# Altium schematic sheet obc-v2_FRAM-FLASH.SchDoc
size 420 x 297 mm; SheetNumber: 8; SheetTotal: 23
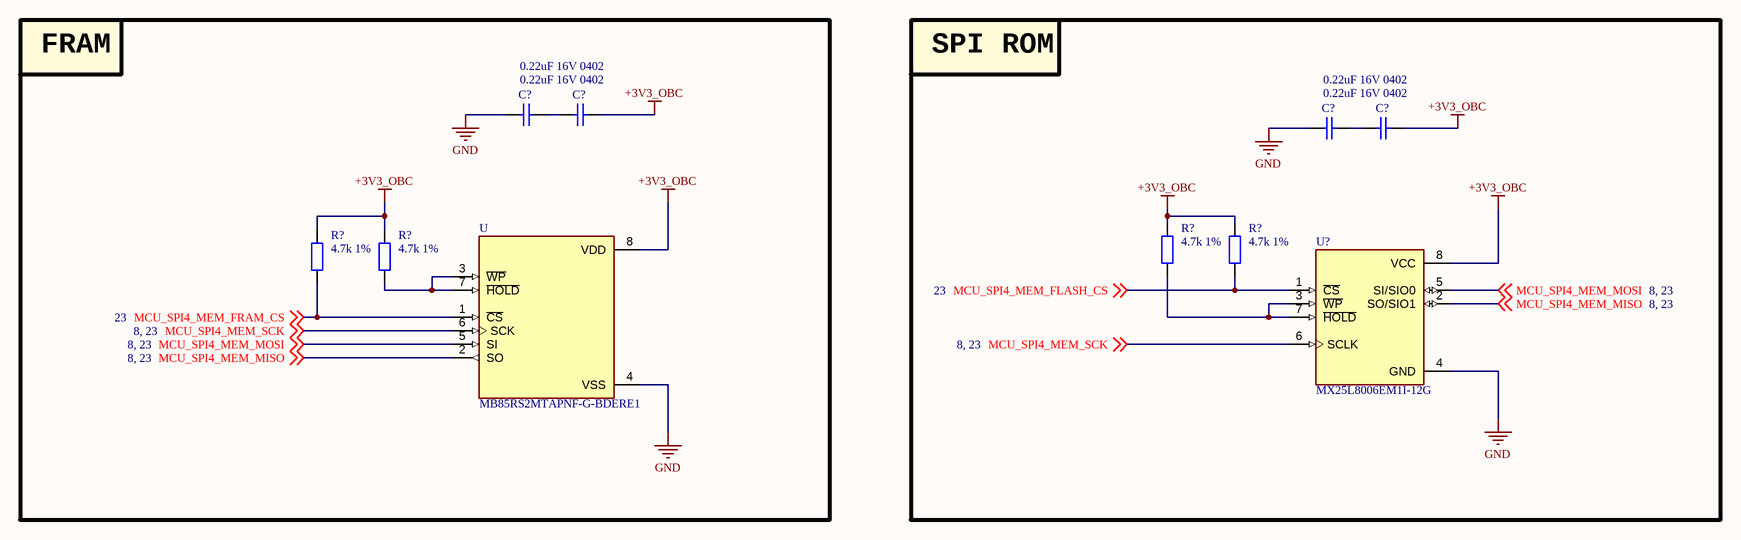
[diagram p0: obc-v2_FRAM-FLASH.SchDoc]

## Parts
(Parts that share a designator on the sheet are numbered #1, #2 ... from top to bottom, then left to right.)
C?#1  0.22uF 16V 0402  [tu 0402]
C?#2  0.22uF 16V 0402  [tu 0402]
C?#3  0.22uF 16V 0402  [tu 0402]
C?#4  0.22uF 16V 0402  [tu 0402]
R?#1  4.7k 1%  [tro smd 0603]
R?#2  4.7k 1%  [tro smd 0603]
R?#3  4.7k 1%  [tro smd 0603]
R?#4  4.7k 1%  [tro smd 0603]
U  MB85RS2MTAPNF-G-BDERE1  [SOIC127P602X173-8N]
U?  MX25L8006EM1I-12G  [SOIC127P600X175-8N]

## Blocks framed on the sheet
FRAM: C?#1 C?#2 R?#3 R?#4 U
SPI ROM: C?#3 C?#4 R?#1 R?#2 U?

## Nets
+3V3_OBC: C?#2.1 C?#4.1 R?#1.2 R?#2.2 R?#3.2 R?#4.2 U.8(VDD) U?.8(VCC)
GND: C?#1.2 C?#3.2 U.4(VSS) U?.4(GND)
MCU_SPI4_MEM_FLASH_CS: R?#2.1 U?.1(~{CS}) ; off-sheet MCU_SPI4_MEM_FLASH_CS
MCU_SPI4_MEM_FRAM_CS: R?#3.1 U.1(~{CS}) ; off-sheet MCU_SPI4_MEM_FRAM_CS
MCU_SPI4_MEM_MISO: U.2(SO) U?.2(SO/SIO1) ; off-sheet MCU_SPI4_MEM_MISO
MCU_SPI4_MEM_MOSI: U.5(SI) U?.5(SI/SIO0) ; off-sheet MCU_SPI4_MEM_MOSI
MCU_SPI4_MEM_SCK: U.6(SCK) U?.6(SCLK) ; off-sheet MCU_SPI4_MEM_SCK
NetC?#1_1: C?#1.1 C?#2.2
NetC?#3_1: C?#3.1 C?#4.2
NetR?#1_1: R?#1.1 U?.3(~{WP}) U?.7(~{HOLD})
NetR?#4_1: R?#4.1 U.3(~{WP}) U.7(~{HOLD})

## Notes on the sheet
- Project:
- Sub-system:
- Design by:
- Sheet title:
- Sheet
- A3
- of
- Checked by:
- Approved by:
- Revision:
- Document No:
- Size:
- Date:

## Library data of the parts
C?#1-C?#4 = Tu 0402 33nF 10V: 0.22 µF ±10% 16V Ceramic Capacitor X7R 0402 (1005 Metric): GCM155R71C224KE02D; Chung_Loai: Dán; Don_Vi: Con; So_Chan: 2; Ten_Linh_Kien: Tụ 0402 33nF X7R 10V GRM155R71A333KA01D; Ma_Hang: MH007853; Kieu_Chan: *
R?#1-R?#4 = Tro 0603 1% 10k: RES 4.7K OHM 1% 1/10W 0603, P/N: ERJ-U03F4701V; Chung_Loai: Dán; Don_Vi: Con; So_Chan: 2; Ten_Linh_Kien: Trở 0603 1% 10k; Ma_Hang: MH006333; Kieu_Chan: *
U = MB85RS2MTAPNF-G-BDERE1: FRAM _Ferroelectric RAM_ Memory IC 2Mb _256K x 8_ SPI 40MHz 8-SOP; MF: Fujitsu Electronics; Package: SO-8 Fujitsu; Value: *; Digi-Key_Purchase_URL: https://www.digikey.com/product-detail/en/fujitsu-electronics-america-inc/MB85RS2MTAPNF-G-BDERE1/865-1286-1-ND/7916252?utm_source=snapeda&utm_medium=aggregator&utm_campaign=symbol; Digi-Key_Part_Number: 865-1286-1-ND; SnapEDA_Link: https://www.snapeda.com/parts/MB85RS2MTAPNF-G-BDERE1/Fujitsu%20Electronics%20America%2C%20Inc./view-part/2344795/?ref=snap; MP: MB85RS2MTAPNF-G-BDERE1
U? = MX25L8006EM1I-12G: FLASH - NOR Memory IC 8Mb (1M x 8) SPI 86 MHz 8-SOP; MF: Macronix; SnapEDA_Link: https://www.snapeda.com/parts/MX25L8006EM1I-12G/Macronix/view-part/?ref=snap; Package: SOP-8 Macronix; Value: *; MP: MX25L8006EM1I-12G; Check_prices: https://www.snapeda.com/parts/MX25L8006EM1I-12G/Macronix/view-part/?ref=eda